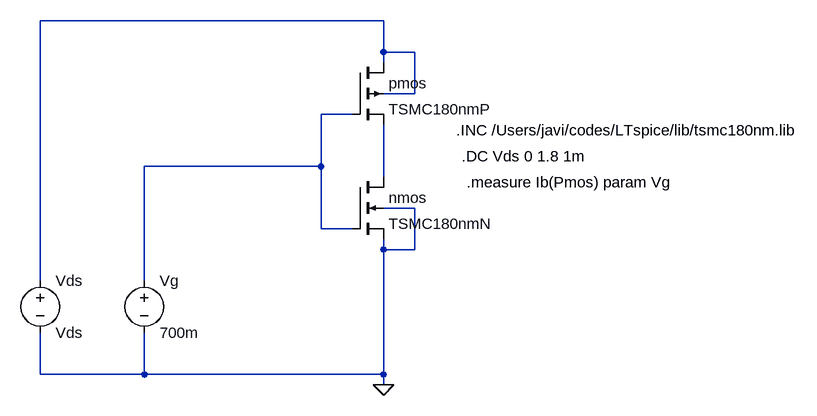
[diagram p0: schematic Draft1.asc]
Draft1.asc, the LTspice schematic file:
Version 4
SHEET 1 1216 688
WIRE 480 96 -48 96
WIRE 480 144 480 96
WIRE 528 144 480 144
WIRE 480 160 480 144
WIRE 528 208 528 144
WIRE 528 208 480 208
WIRE 432 240 384 240
WIRE 384 320 384 240
WIRE 384 320 112 320
WIRE 480 336 480 256
WIRE 528 384 480 384
WIRE 384 416 384 320
WIRE 432 416 384 416
WIRE 480 448 480 432
WIRE 528 448 528 384
WIRE 528 448 480 448
WIRE -48 496 -48 96
WIRE 112 496 112 320
WIRE -48 640 -48 576
WIRE 112 640 112 576
WIRE 112 640 -48 640
WIRE 480 640 480 448
WIRE 480 640 112 640
WIRE 480 656 480 640
FLAG 480 656 0
SYMBOL nmos4 432 336 R0
SYMATTR InstName nmos
SYMATTR Value TSMC180nmN
SYMATTR Value2 l=0.18um w=1um
SYMBOL pmos4 432 160 R0
SYMATTR InstName pmos
SYMATTR Value TSMC180nmP
SYMATTR Value2 l=0.18um w=1.0um
SYMBOL voltage 112 480 R0
SYMATTR InstName Vg
SYMATTR Value 700m
SYMBOL voltage -48 480 R0
SYMATTR InstName Vds
SYMATTR Value Vds
TEXT 592 264 Left 2 !.INC /Users/javi/codes/LTspice/lib/tsmc180nm.lib
TEXT 600 304 Left 2 !.DC Vds 0 1.8 1m
TEXT 608 344 Left 2 !.measure Ib(Pmos) param Vg

The netlist it stands for:
* Draft1.asc
M§nmos N003 N002 0 0 TSMC180nmN l=0.18um w=1um
M§pmos N001 N002 N003 N001 TSMC180nmP l=0.18um w=1.0um
Vg N002 0 700m
Vds N001 0 Vds
.model NMOS NMOS
.model PMOS PMOS
.lib standard.mos
.INC /Users/javi/codes/LTspice/lib/tsmc180nm.lib
.DC Vds 0 1.8 1m
.measure Ib(Pmos) param Vg
.backanno
.end